# EAGLE design mailbox (EAGLE 6.6.0)
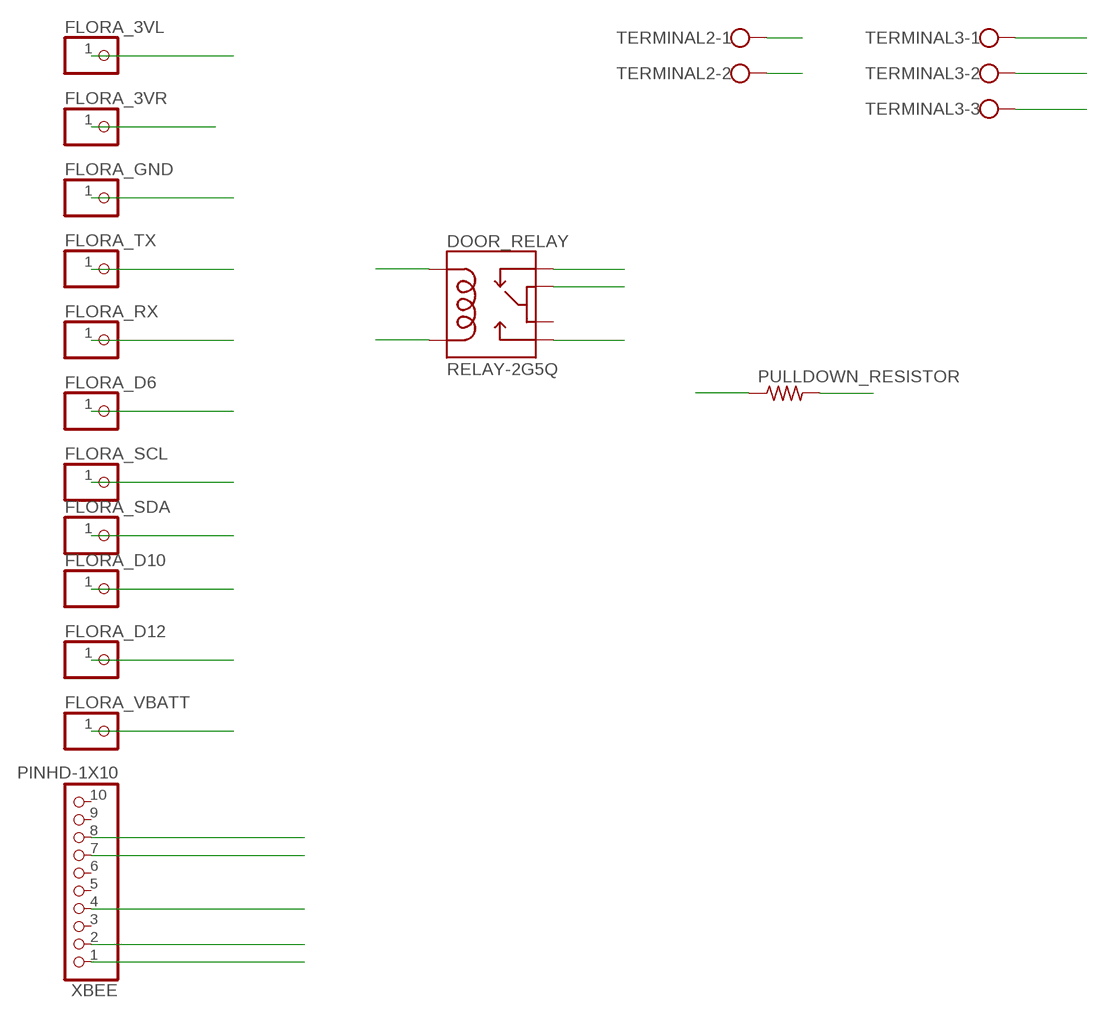
[diagram p0: schematic, sheet 1]

## Parts
DOOR_RELAY  RELAY-2G5Q  [RELAY-G5V]
FLORA_3VL  PINHD-1X1CB  [1X01-CLEANBIG]
FLORA_3VR  PINHD-1X1CB  [1X01-CLEANBIG]
FLORA_D6  PINHD-1X1CB  [1X01-CLEANBIG]
FLORA_D10  PINHD-1X1CB  [1X01-CLEANBIG]
FLORA_D12  PINHD-1X1CB  [1X01-CLEANBIG]
FLORA_GND  PINHD-1X1CB  [1X01-CLEANBIG]
FLORA_RX  PINHD-1X1CB  [1X01-CLEANBIG]
FLORA_SCL  PINHD-1X1CB  [1X01-CLEANBIG]
FLORA_SDA  PINHD-1X1CB  [1X01-CLEANBIG]
FLORA_TX  PINHD-1X1CB  [1X01-CLEANBIG]
FLORA_VBATT  PINHD-1X1CB  [1X01-CLEANBIG]
PULLDOWN_RESISTOR  FLIPFLOP-RES  [0805-THM]
TERMINAL2  W237-102  [W237-102]
TERMINAL3  W237-103  [W237-103]
XBEE  PINHD-1X10  [1X10-BIG]

## Nets
3VL: DOOR_RELAY.1 DOOR_RELAY.2 FLORA_3VL.1
3VR: FLORA_3VR.1 XBEE.1
D6: FLORA_D6.1 TERMINAL3.1
D10: FLORA_D10.1
D12: FLORA_D12.1 PULLDOWN_RESISTOR.1 TERMINAL3.2
DOOR_SWITCH: DOOR_RELAY.9 TERMINAL2.2
GND: DOOR_RELAY.10 FLORA_GND.1 PULLDOWN_RESISTOR.2 TERMINAL2.1 XBEE.4
RX: FLORA_TX.1 XBEE.7
SCL: DOOR_RELAY.5 FLORA_SCL.1
SDA: FLORA_SDA.1 XBEE.2
TX: FLORA_RX.1 XBEE.8
VBATT: FLORA_VBATT.1 TERMINAL3.3
Unconnected: DOOR_RELAY.6 XBEE.3 XBEE.5 XBEE.6 XBEE.9 XBEE.10

## Library data of the parts
DOOR_RELAY = SparkFun-Electromechanical:RELAY-2: SPDT relay (COM-00100)
FLORA_3VL FLORA_3VR FLORA_D6 FLORA_D10 FLORA_D12 FLORA_GND FLORA_RX FLORA_SCL FLORA_SDA FLORA_TX FLORA_VBATT = adafruit:PINHD-1X1: Pin header 1x1 for 0.1" spacing With round pins
PULLDOWN_RESISTOR = adafruit:FLIPFLOP-RES: Flip Flop resistor An 0805 resistor inside a standard 1/4W 5% resistor. Makes for easy mods
TERMINAL2 = con-wago-500:W237-102: WAGO SCREW CLAMP; MPN: 237-102; OC_FARNELL: unknown; OC_NEWARK: 70K9898
TERMINAL3 = con-wago-500:W237-103: WAGO SCREW CLAMP; MPN: 237-103; OC_FARNELL: unknown; OC_NEWARK: 18M7116
XBEE = adafruit:PINHD-1X10: Pin header 1x10 0.1" spacing With round pins

## Board
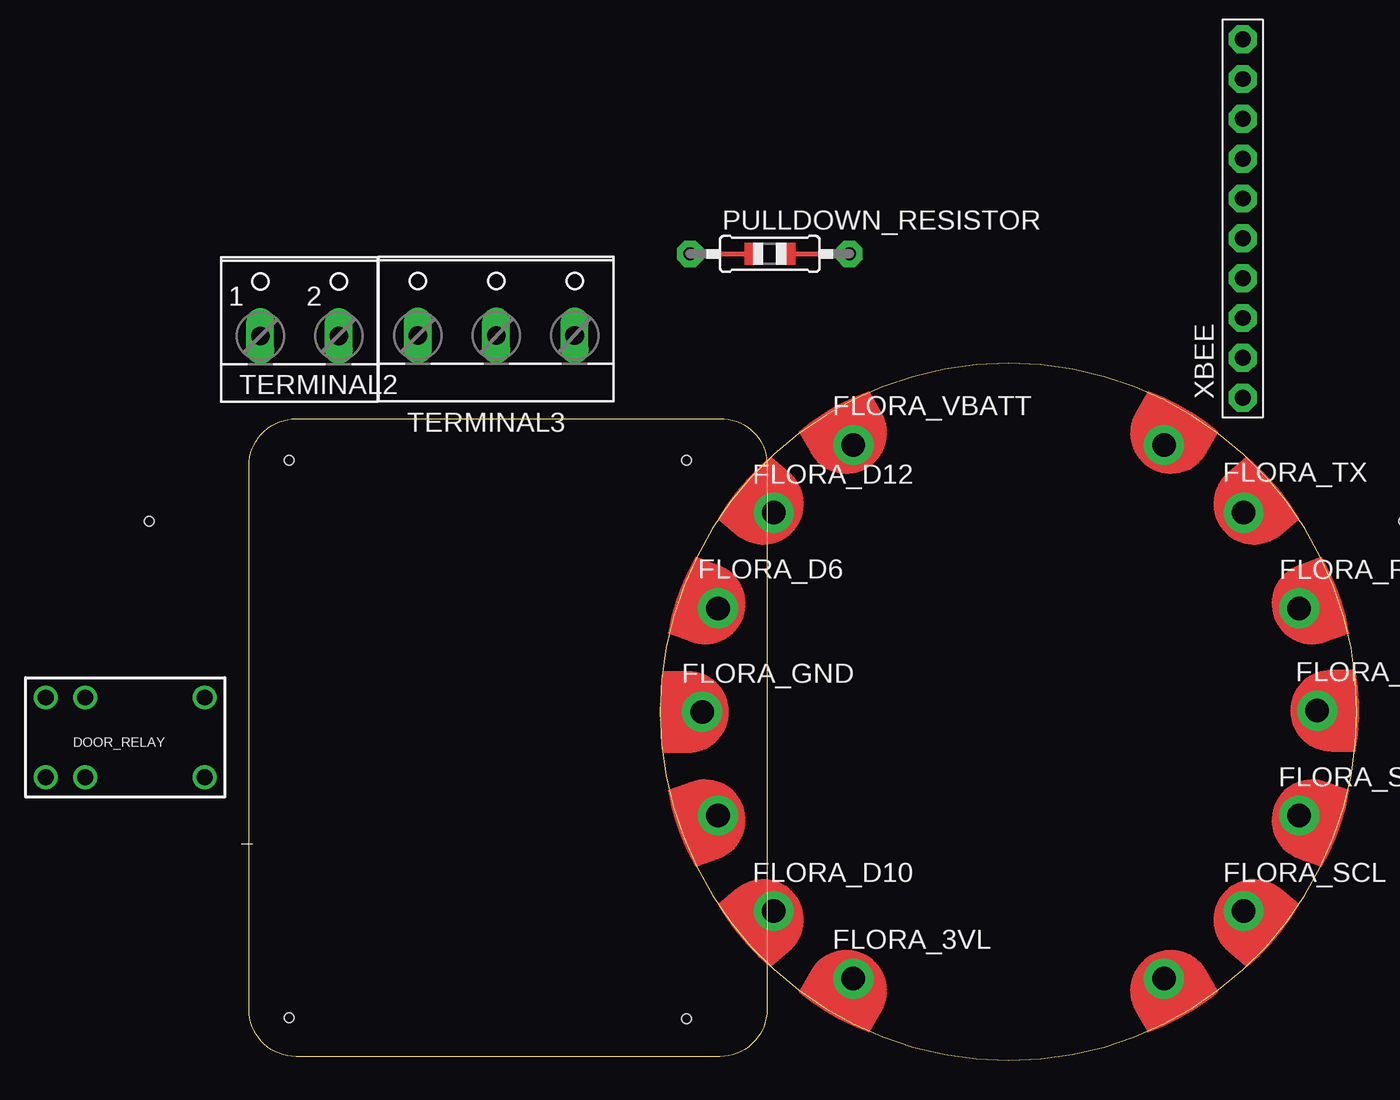
[diagram p1: board, top side]
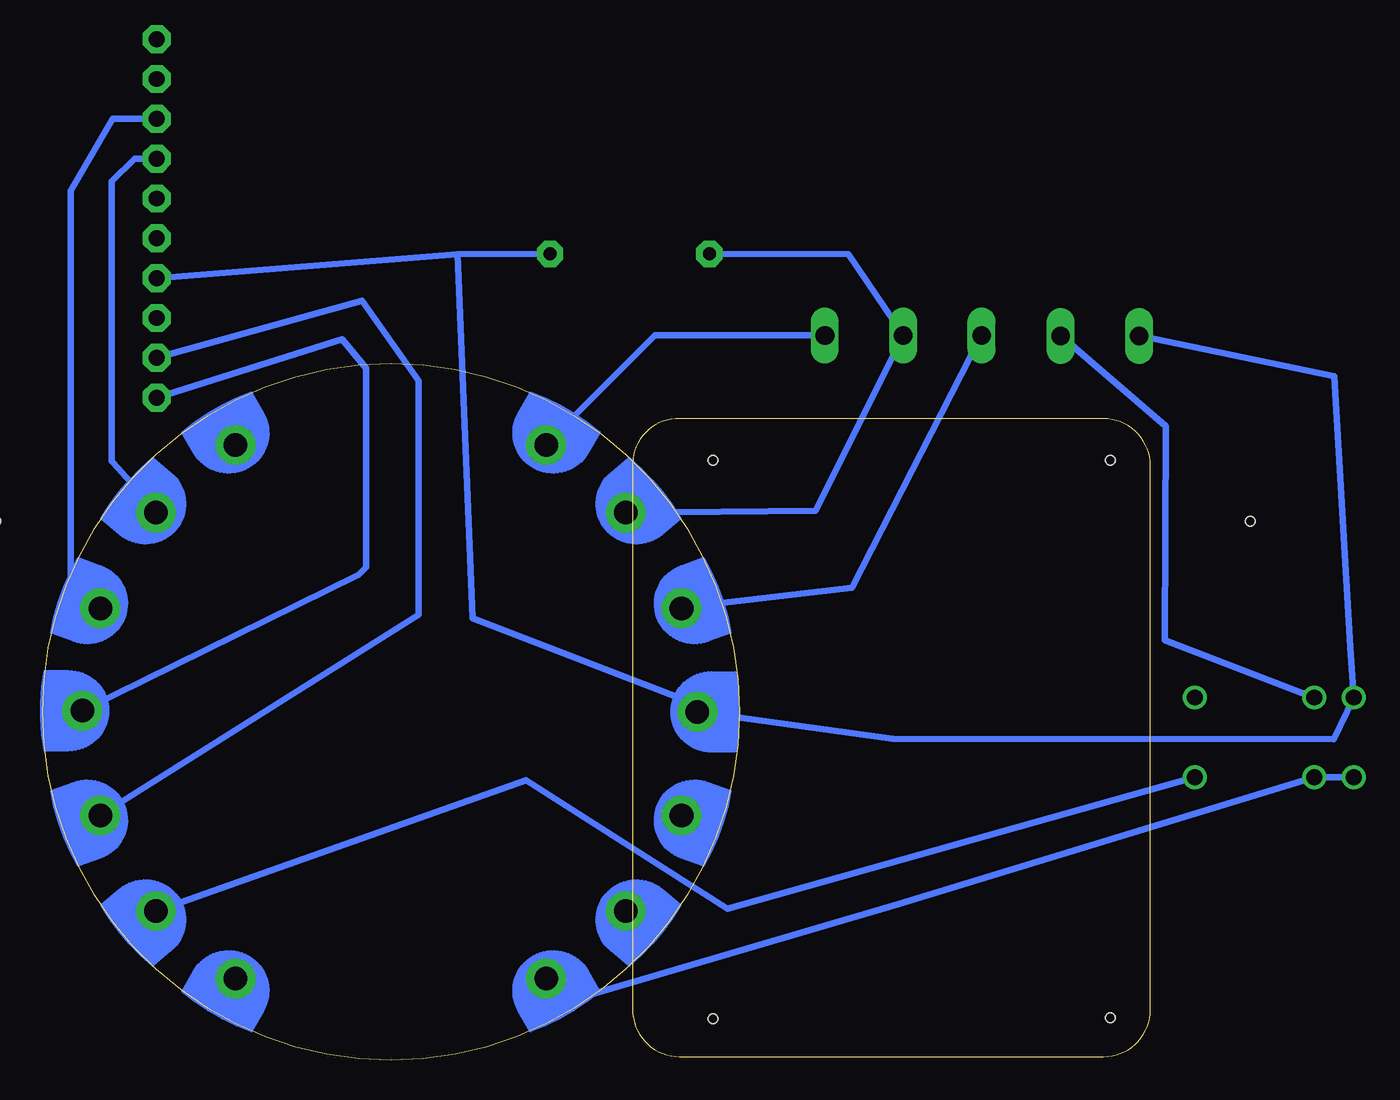
[diagram p2: board, bottom side, seen from below]

Size 70.69 x 44.45 mm. Coordinates in mm from the lower left corner, seen from the top.
Outline: 70.69,22.23 arc90 48.46,44.45 arc90 26.24,22.23 arc90 48.46,0 arc90 70.69,22.23
Outline: 3,40.92 30.05,40.92 arc-90 33.05,38.1 33.05,3.24 arc-90 30.05,0.24 3,0.24 arc-90 0,3.24 0,37.92 arc-90 3,40.92
Copper layers (1*16): Top 0.035mm / dielectric 1.5mm / Bottom 0.035mm
Design rules "default": minimum track width 10mil, minimum drill 24mil, track to track 8mil, track to pad 8mil, pad to pad 8mil, via to via 8mil, smd to smd 8mil, copper to edge 40mil, drill to drill 8mil, minimum pad ring 10mil, minimum via ring 8mil, stop-mask expansion 4mil, vias tented up to drill 0mil, thermal gap 10mil
Holes 0.6 mm at -6.38,34.39 73.69,34.39 2.57,38.28 27.91,38.28 2.57,2.72 27.91,2.64

### Footprints (pad centres in the part's own frame; a part is rotated, then mirrored left to right if it is on the bottom)
SEWINGTAP_2.0 = drill 1.5 pad 2.54: P$1 0,0
RELAY-G5V = drill 1.016: 1 5.08,2.54; 2 2.54,2.54; 5 -5.08,2.54; 6 -5.08,-2.54; 9 2.54,-2.54; 10 5.08,-2.54
1X01-CLEANBIG = drill 1.016 pad 1.778: 1 0,0
0805-THM = drill 0.813 pad 1.676 octagon: 1 -5.08,0; 2 5.08,0
W237-102 = drill 1.194 long: 1 -2.5,-1.27; 2 2.5,-1.27
W237-103 = drill 1.194 long: 1 -5,-1.29; 2 0,-1.29; 3 5,-1.29
1X10-BIG = drill 1.016 pad 1.778 octagon: 1 -11.43,0; 2 -8.89,0; 3 -6.35,0; 4 -3.81,0; 5 -1.27,0; 6 1.27,0; 7 3.81,0; 8 6.35,0; 9 8.89,0; 10 11.43,0

### Placement (x,y rotation side)
3.3VTAP  SEWTAP-2.0IN  [SEWINGTAP_2.0]  68.15,22.3 270 top
3V3TAP2  SEWTAP-2.0IN  [SEWINGTAP_2.0]  38.56,5.21 150 top
D6  SEWTAP-2.0IN  [SEWINGTAP_2.0]  29.92,28.83 70 top
DOOR_RELAY  -7.9,20.6 180 top
FLORA_3VL  38.56,5.26 0 top
FLORA_3VR  68.1,22.33 0 top
FLORA_D6  29.97,28.88 0 top
FLORA_D10  33.45,9.53 0 top
FLORA_D12  33.45,34.93 0 top
FLORA_GND  28.93,22.22 0 top
FLORA_RX  67.06,28.85 0 top
FLORA_SCL  63.47,9.53 0 top
FLORA_SDA  67.01,15.62 0 top
FLORA_TX  63.45,35.05 0 top
FLORA_VBATT  38.56,39.29 0 top
GND3TAP  SEWTAP-2.0IN  [SEWINGTAP_2.0]  58.37,5.21 210 top
GNDTAP  SEWTAP-2.0IN  [SEWINGTAP_2.0]  28.91,22.22 90 top
GNDTAP2  SEWTAP-2.0IN  [SEWINGTAP_2.0]  58.37,39.24 330 top
IO9  SEWTAP-2.0IN  [SEWINGTAP_2.0]  29.92,15.62 110 top
IO10  SEWTAP-2.0IN  [SEWINGTAP_2.0]  33.48,9.53 130 top
IO12  SEWTAP-2.0IN  [SEWINGTAP_2.0]  33.48,34.93 50 top
PULLDOWN_RESISTOR  33.22,51.44 0 top  (outside the outline)
RX  SEWTAP-2.0IN  [SEWINGTAP_2.0]  67.01,28.83 290 top
SCL  SEWTAP-2.0IN  [SEWINGTAP_2.0]  63.45,9.53 230 top
SDA  SEWTAP-2.0IN  [SEWINGTAP_2.0]  67.01,15.62 250 top
TERMINAL2  3.23,47.47 0 top
TERMINAL3  15.77,47.52 0 top
TX  SEWTAP-2.0IN  [SEWINGTAP_2.0]  63.45,34.93 310 top
VCC2  SEWTAP-2.0IN  [SEWINGTAP_2.0]  38.56,39.24 30 top
XBEE  63.4,53.7 90 top

### Tracks (layer width: path | path; a pad name or v marks a point on that pad's centre or on a via)
3VL
  Bottom 0.406: FLORA_3VL.1 35.97,4.11 16.13,9.96 DOOR_RELAY.2 DOOR_RELAY.1
3VR
  Bottom 0.406: XBEE.1 51.56,45.97 50.04,44.15 50.04,31.45 50.52,30.96 FLORA_3VR.1
D6
  Bottom 0.406: FLORA_D6.1 19.05,30.15 TERMINAL3.1
D12
  Bottom 0.406: FLORA_D12.1 21.36,35.05 TERMINAL3.2 19.28,51.41 PULLDOWN_RESISTOR.1
DOOR_SWITCH
  Bottom 0.406: DOOR_RELAY.9 -0.91,26.8 -0.99,40.44 TERMINAL2.2
GND
  Top 0.406: FLORA_GND.1 28.59,22.56 27.76,21.41 27.76,21.11
  Bottom 0.406: DOOR_RELAY.10 -12.75,26.34 -11.73,43.64 TERMINAL2.1 | DOOR_RELAY.10 -12.9,23.14 | DOOR_RELAY.10 -11.68,20.47 16.46,20.52 FLORA_GND.1 28.59,22.56 43.26,28.19 44.2,51.41 | XBEE.4 44.2,51.41 | 44.2,51.41 PULLDOWN_RESISTOR.2
RX
  Bottom 0.406: XBEE.7 64.82,57.51 66.27,56.06 66.27,38.2 66.19,38.13 FLORA_TX.1
SCL
  Top 0.406: 62.89,10.03 FLORA_SCL.1
  Bottom 0.406: DOOR_RELAY.5 26.98,9.68 39.83,17.86 FLORA_SCL.1 62.89,10.03
SDA
  Bottom 0.406: XBEE.2 50.29,48.44 46.71,43.33 46.71,28.42 FLORA_SDA.1
TX
  Bottom 0.406: XBEE.8 66.22,60.05 68.89,55.45 68.89,28.78 FLORA_RX.1
VBATT
  Bottom 0.406: TERMINAL3.3 31.62,46.23 FLORA_VBATT.1

### Text on the board
tDocu: GND | VBATT | TX | D12 | RX | D6 | GND | 3.3V | D9 | SDA | D10 | SCL | 3.3V | GND